# EAGLE design MITAvionicsRevA (EAGLE 7.2.0)
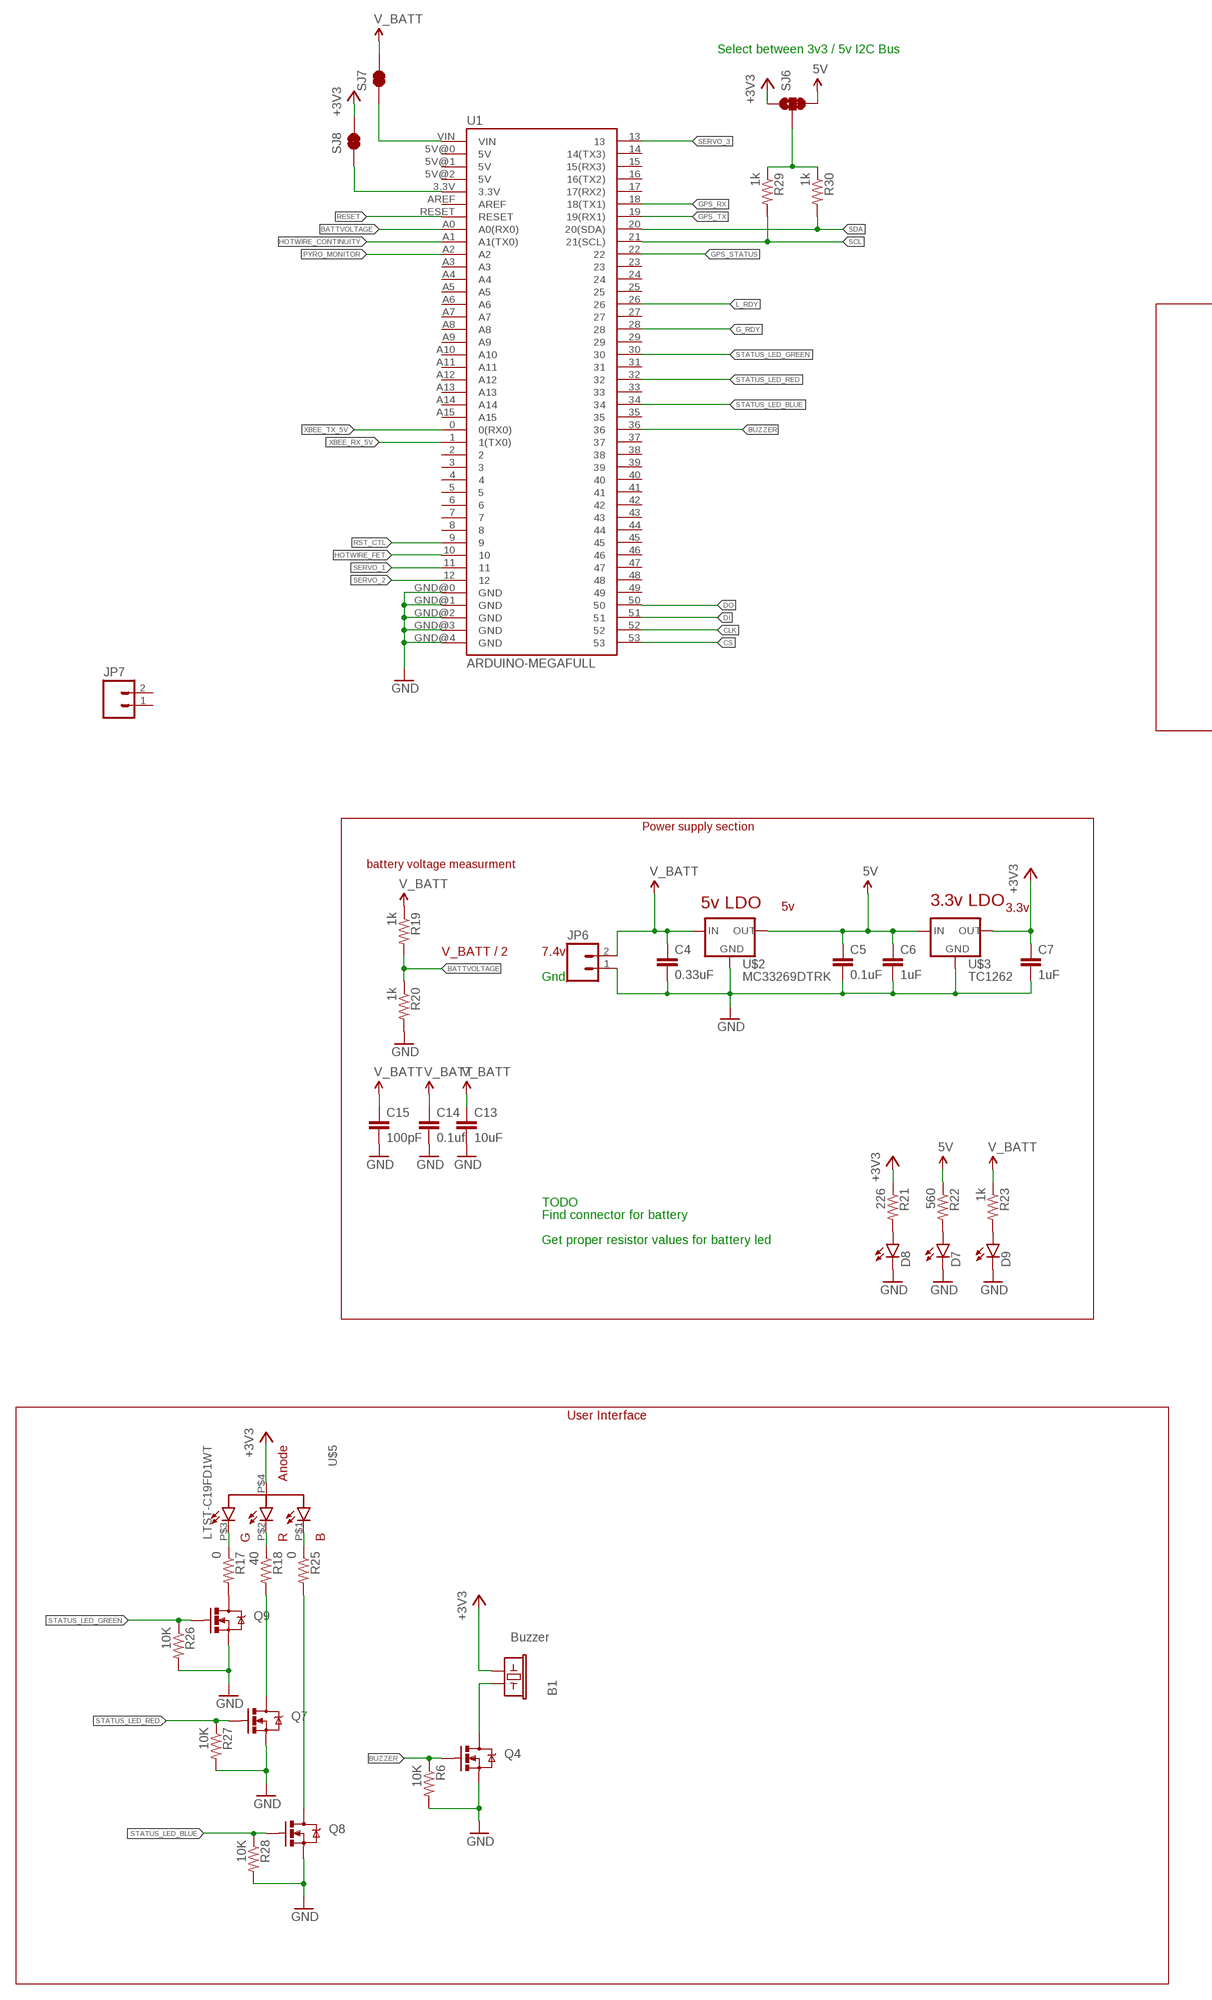
[diagram p0: schematic, sheet 1, part 1 of 2]
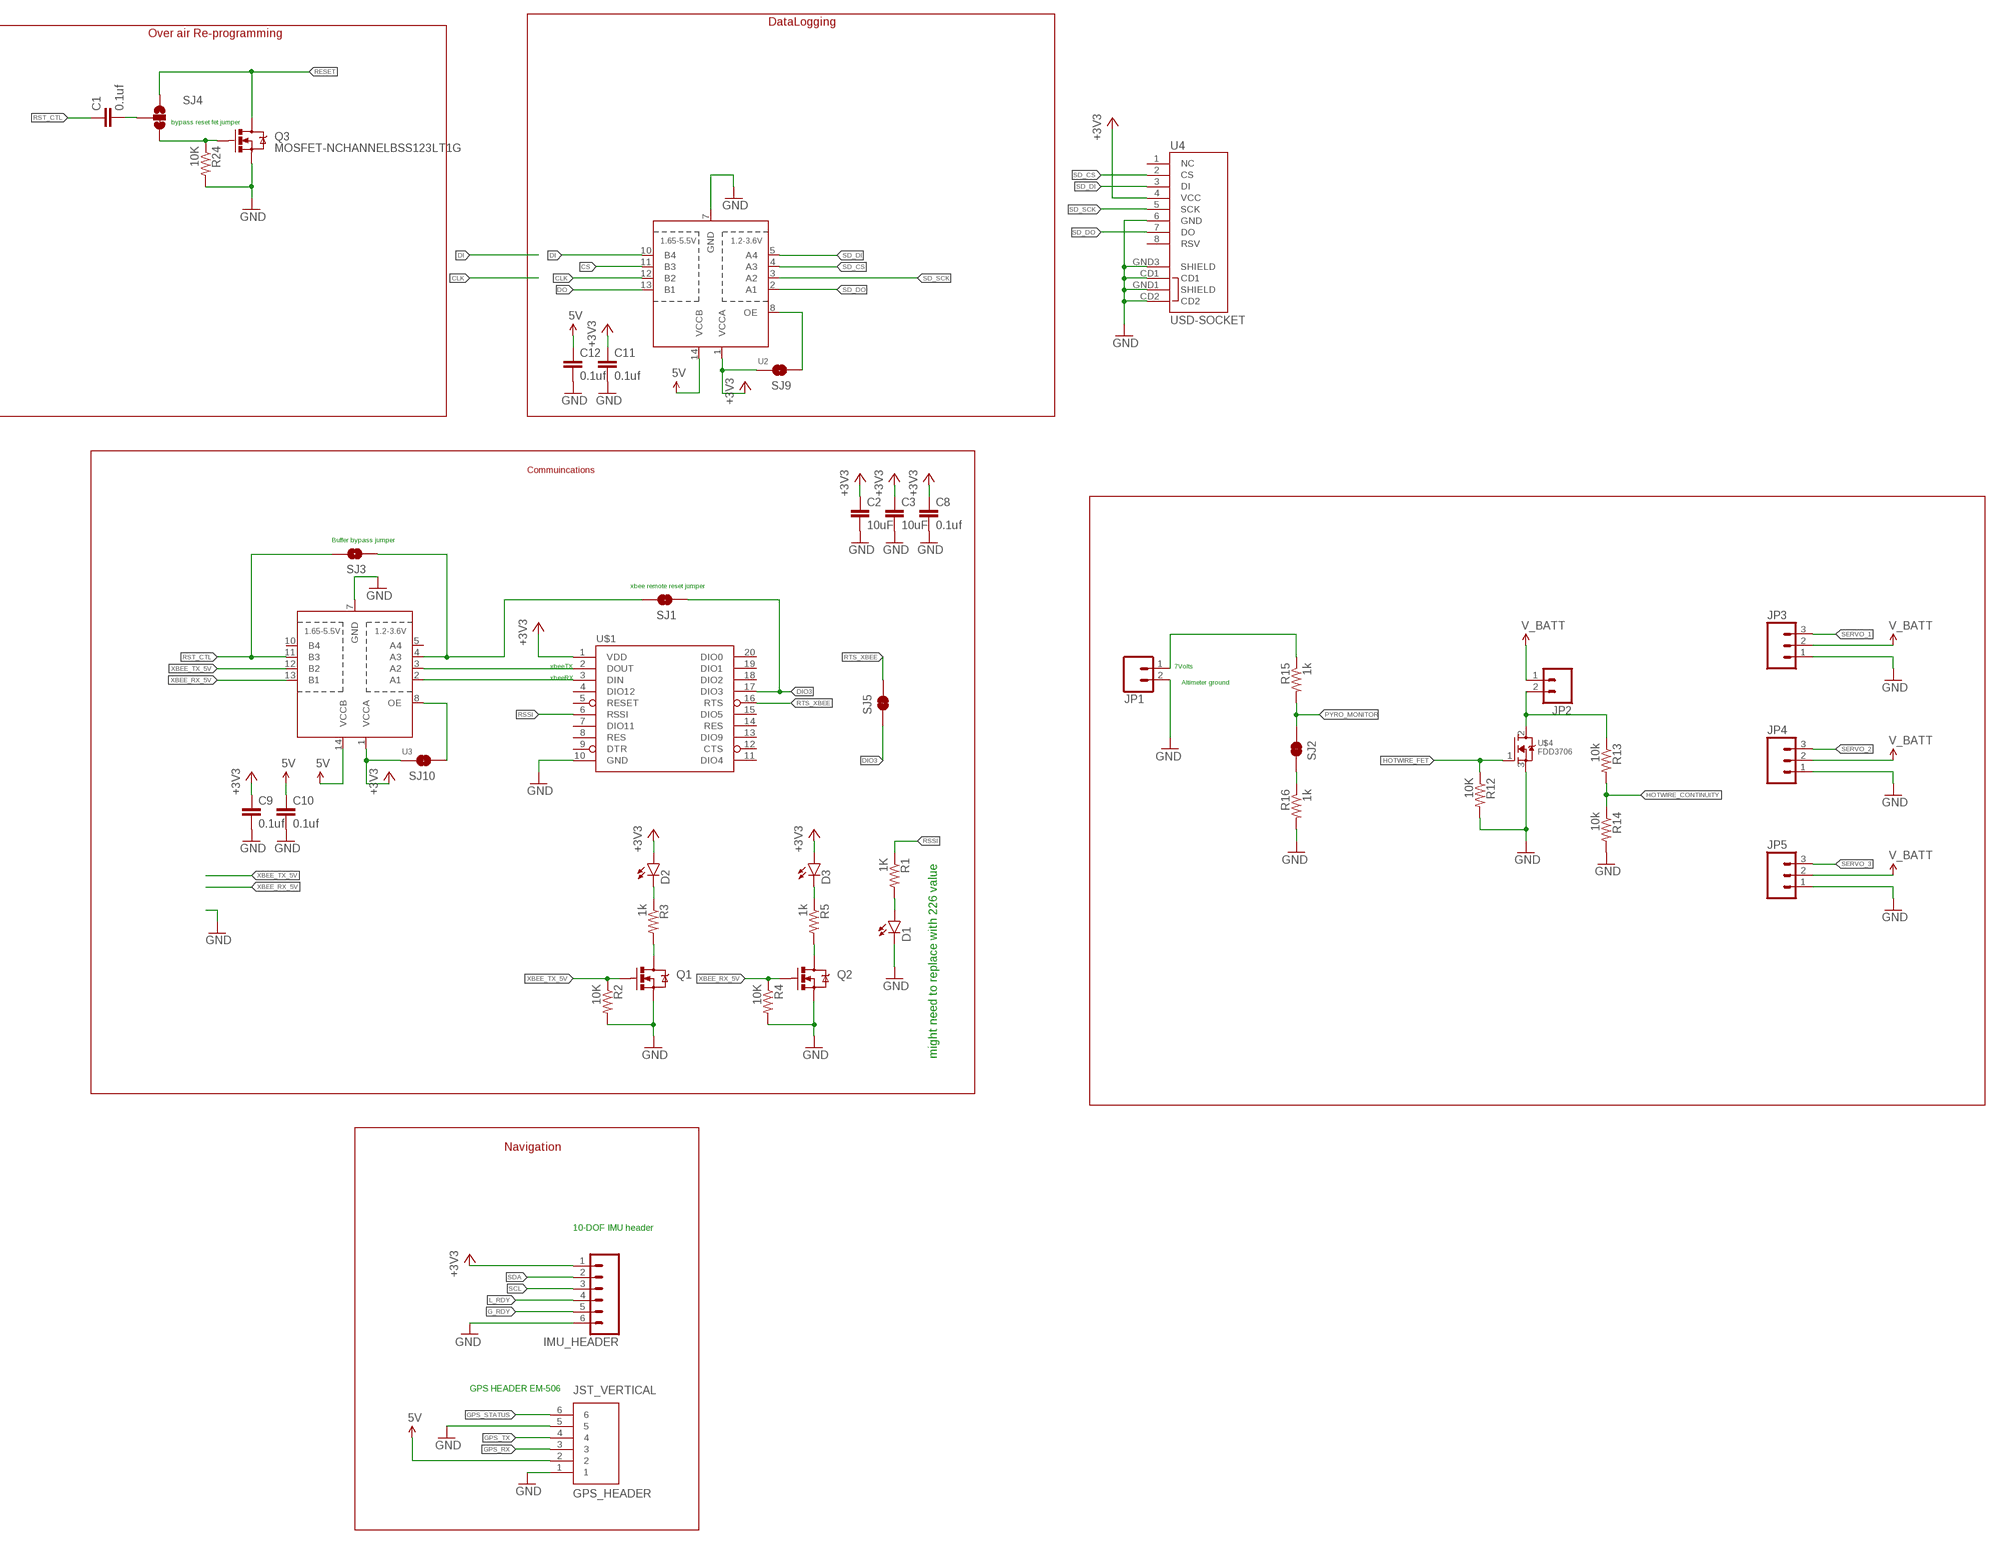
[diagram p1: schematic, sheet 1, part 2 of 2]

## Parts
B1  Buzzer  BUZZERSMD2  [BUZZER-CCV]
C1  0.1uf  CAP0805  [0805]
C2  10uF  CAP0805  [0805]
C3  10uF  CAP0805  [0805]
C4  0.33uF  CAP0805  [0805]
C5  0.1uF  CAP0805  [0805]
C6  1uF  CAP0805  [0805]
C7  1uF  CAP0805  [0805]
C8  0.1uf  CAP0805  [0805]
C9  0.1uf  CAP0805  [0805]
C10  0.1uf  CAP0805  [0805]
C11  0.1uf  CAP0805  [0805]
C12  0.1uf  CAP0805  [0805]
C13  10uF  CAP0805  [0805]
C14  0.1uf  CAP0805  [0805]
C15  100pF  CAP0805  [0805]
D1  LED1206  [LED-1206]
D2  LED1206  [LED-1206]
D3  LED1206  [LED-1206]
D7  LED1206  [LED-1206]
D8  LED1206  [LED-1206]
D9  LED1206  [LED-1206]
GPS_HEADER  JST_VERTICAL  [JST-6-SMD-VERT-1.0MM]
IMU_HEADER  M06SMD-1MM  [1X06-1MM]
JP1  M023.5MM  [SCREWTERMINAL-3.5MM-2]
JP2  M023.5MM  [SCREWTERMINAL-3.5MM-2]
JP3  M03PTH  [1X03]
JP4  M03PTH  [1X03]
JP5  M03PTH  [1X03]
JP6  M023.5MM  [SCREWTERMINAL-3.5MM-2]
JP7  M02PTH  [1X02]
Q1  MOSFET-NCHANNELBSS123LT1G  [SOT23-3]
Q2  MOSFET-NCHANNELBSS123LT1G  [SOT23-3]
Q3  MOSFET-NCHANNELBSS123LT1G  [SOT23-3]
Q4  MOSFET-NCHANNELBSS123LT1G  [SOT23-3]
Q7  MOSFET-NCHANNELBSS123LT1G  [SOT23-3]
Q8  MOSFET-NCHANNELBSS123LT1G  [SOT23-3]
Q9  MOSFET-NCHANNELBSS123LT1G  [SOT23-3]
R1  1K  RESISTOR0805-RES  [0805]
R2  10K  RESISTOR0805-RES  [0805]
R3  1k  RESISTOR0805-RES  [0805]
R4  10K  RESISTOR0805-RES  [0805]
R5  1k  RESISTOR0805-RES  [0805]
R6  10K  RESISTOR0805-RES  [0805]
R12  10K  RESISTOR0805-RES  [0805]
R13  10k  RESISTOR0805-RES  [0805]
R14  10k  RESISTOR0805-RES  [0805]
R15  1k  RESISTOR0805-RES  [0805]
R16  1k  RESISTOR0805-RES  [0805]
R17  0  RESISTOR0805-RES  [0805]
R18  40  RESISTOR0805-RES  [0805]
R19  1k  RESISTOR0805-RES  [0805]
R20  1k  RESISTOR0805-RES  [0805]
R21  226  RESISTOR0805-RES  [0805]
R22  560  RESISTOR0805-RES  [0805]
R23  1k  RESISTOR0805-RES  [0805]
R24  10K  RESISTOR0805-RES  [0805]
R25  0  RESISTOR0805-RES  [0805]
R26  10K  RESISTOR0805-RES  [0805]
R27  10K  RESISTOR0805-RES  [0805]
R28  10K  RESISTOR0805-RES  [0805]
R29  1k  RESISTOR0805-RES  [0805]
R30  1k  RESISTOR0805-RES  [0805]
SJ1  JUMPER-PAD-2-NC_BY_TRACE  [PAD-JUMPER-2-NC_BY_TRACE_YES_SILK]
SJ2  JUMPER-PAD-2-NC_BY_TRACE  [PAD-JUMPER-2-NC_BY_TRACE_YES_SILK]
SJ3  JUMPER-PAD-2-NOYES_SILK  [PAD-JUMPER-2-NO_YES_SILK]
SJ4  JUMPER-PAD-3-2OF3_NC_BY_TRACE_SMALL  [PAD-JUMPER-3-2OF3_NC_BY_TRACE_YES_SILK_FULL_BOX]
SJ5  JUMPER-PAD-2-NC_BY_TRACE  [PAD-JUMPER-2-NC_BY_TRACE_YES_SILK]
SJ6  JUMPER-PAD-3-2OF3_NC_BY_TRACE_SMALL  [PAD-JUMPER-3-2OF3_NC_BY_TRACE_YES_SILK_FULL_BOX]
SJ7  JUMPER-PAD-2-NC_BY_TRACE  [PAD-JUMPER-2-NC_BY_TRACE_YES_SILK]
SJ8  JUMPER-PAD-2-NC_BY_TRACE  [PAD-JUMPER-2-NC_BY_TRACE_YES_SILK]
SJ9  JUMPER-PAD-2-NC_BY_TRACE  [PAD-JUMPER-2-NC_BY_TRACE_YES_SILK]
SJ10  JUMPER-PAD-2-NC_BY_TRACE  [PAD-JUMPER-2-NC_BY_TRACE_YES_SILK]
U1  ARDUINO-MEGAFULL  [ARDUINO_MEGA]
U2  TXB0104PWRSOIC14  [SO14]
U3  TXB0104PWRSOIC14  [SO14]
U4  USD-SOCKET  [MICROSD_1:1]
U$1  XBEE-1B3  [XBEE-SMD]
U$2  MC33269DTRK  [TO-252]
U$3  TC1262  [SOT223]
U$4  FDD3706  [TO-252]
U$5  LTST-C19FD1WT  [SMD-4]

## Nets
5V: C5.1 C6.1 C10.1 C12.1 GPS_HEADER.2 R22.1 SJ6.3 U2.14(VCCB) U3.14(VCCB) U$2.2(OUT) U$3.1(IN)
+3V3: B1.- C2.1 C3.1 C7.1 C8.1 C9.1 C11.1 D2.A D3.A IMU_HEADER.1 R21.1 SJ6.1 SJ8.2 SJ9.2 SJ10.2 U2.1(VCCA) U3.1(VCCA) U4.4(VCC) U$1.1(VDD) U$3.3(OUT) U$5.P$4(VCC)
BATTVOLTAGE: R19.2 R20.1 U1.A0(A0(RX0))
BUZZER: Q4.1(G) R6.1 U1.36
CLK: U1.52 U2.12(B2)
CS: U1.53 U2.11(B3)
DI: U1.51 U2.10(B4)
DIO3: SJ1.1 SJ5.1 U$1.17(DIO3)
DO: U1.50 U2.13(B1)
G_RDY: IMU_HEADER.5 U1.28
GND: C2.2 C3.2 C4.2 C5.2 C6.2 C7.2 C8.2 C9.2 C10.2 C11.2 C12.2 C13.2 C14.2 C15.2 D1.C D7.C D8.C D9.C GPS_HEADER.1 GPS_HEADER.5 IMU_HEADER.6 JP1.2 JP3.1 JP4.1 JP5.1 JP6.1 Q1.2(S) Q2.2(S) Q3.2(S) Q4.2(S) Q7.2(S) Q8.2(S) Q9.2(S) R2.2 R4.2 R6.2 R12.2 R14.2 R16.2 R20.2 R24.2 R26.2 R27.2 R28.2 U1.GND@0(GND) U1.GND@1(GND) U1.GND@2(GND) U1.GND@3(GND) U1.GND@4(GND) U2.7(GND) U3.7(GND) U4.6(GND) U4.CD1 U4.CD2 U4.GND1(SHIELD) U4.GND3(SHIELD) U$1.10(GND) U$2.1(GND) U$3.2(GND) U$4.3(S)
GPS_RX: GPS_HEADER.3 U1.18(18(TX1))
GPS_STATUS: GPS_HEADER.6 U1.22
GPS_TX: GPS_HEADER.4 U1.19(19(RX1))
HOTWIRE_CONTINUITY: R13.2 R14.1 U1.A1(A1(TX0))
HOTWIRE_FET: R12.1 U1.10 U$4.1(G)
L_RDY: IMU_HEADER.4 U1.26
N$1: D1.A R1.2
N$2: SJ1.2 SJ3.1 U3.4(A3)
N$3: SJ8.1 U1.3.3V
N$4: D3.C R5.1
N$5: JP2.2 R13.1 U$4.2(D)
N$6: Q3.1(G) R24.1 SJ4.3
N$7: C1.2 SJ4.2
N$8: B1.+ Q4.3(D)
N$9: Q2.3(D) R5.2
N$10: D2.C R3.1
N$11: Q1.3(D) R3.2
N$15: SJ9.1 U2.8(OE)
N$17: SJ10.1 U3.8(OE)
N$21: Q9.3(D) R17.2
N$22: Q7.3(D) R18.2
N$23: D7.A R22.2
N$24: D8.A R21.2
N$25: D9.A R23.2
N$26: Q8.3(D) R25.2
N$27: JP1.1 R15.1
N$28: R29.1 R30.1 SJ6.2
N$29: SJ7.1 U1.VIN
N$30: R16.1 SJ2.1
N$36: R17.1 U$5.P$3(GREEN)
N$37: R18.1 U$5.P$2(RED)
N$38: R25.1 U$5.P$1(BLUE)
PYRO_MONITOR: R15.2 SJ2.2 U1.A2
RESET: Q3.3(D) SJ4.1 U1.RESET
RSSI: R1.1 U$1.6(RSSI)
RST_CTL: C1.1 SJ3.2 U1.9 U3.11(B3)
RTS_XBEE: SJ5.2 U$1.16(RTS)
SCL: IMU_HEADER.3 R29.2 U1.21(21(SCL))
SD_CS: U2.4(A3) U4.2(CS)
SD_DI: U2.5(A4) U4.3(DI)
SD_DO: U2.2(A1) U4.7(DO)
SD_SCK: U2.3(A2) U4.5(SCK)
SDA: IMU_HEADER.2 R30.2 U1.20(20(SDA))
SERVO_1: JP3.3 U1.11
SERVO_2: JP4.3 U1.12
SERVO_3: JP5.3 U1.13
STATUS_LED_BLUE: Q8.1(G) R28.1 U1.34
STATUS_LED_GREEN: Q9.1(G) R26.1 U1.30
STATUS_LED_RED: Q7.1(G) R27.1 U1.32
V_BATT: C4.1 C13.1 C14.1 C15.1 JP2.1 JP3.2 JP4.2 JP5.2 JP6.2 R19.1 R23.1 SJ7.2 U$2.3(IN)
XBEE_RX_3V3: U3.2(A1) U$1.3(DIN)
XBEE_RX_5V: Q2.1(G) R4.1 U1.1(1(TX0)) U3.13(B1)
XBEE_TX_3V3: U3.3(A2) U$1.2(DOUT)
XBEE_TX_5V: Q1.1(G) R2.1 U1.0(0(RX0)) U3.12(B2)
Unconnected: JP7.1 JP7.2 U1.2 U1.3 U1.4 U1.5 U1.5V@0(5V) U1.5V@1(5V) U1.5V@2(5V) U1.6 U1.7 U1.8 U1.14(14(TX3)) U1.15(15(RX3)) U1.16(16(TX2)) U1.17(17(RX2)) U1.23 U1.24 U1.25 U1.27 U1.29 U1.31 U1.33 U1.35 U1.37 U1.38 U1.39 U1.40 U1.41 U1.42 U1.43 U1.44 U1.45 U1.46 U1.47 U1.48 U1.49 U1.A3 U1.A4 U1.A5 U1.A6 U1.A7 U1.A8 U1.A9 U1.A10 U1.A11 U1.A12 U1.A13 U1.A14 U1.A15 U1.AREF U3.5(A4) U3.10(B4) U4.1(NC) U4.8(RSV) U$1.4(DIO12) U$1.5(RESET) U$1.7(DIO11) U$1.8(RES) U$1.9(DTR) U$1.11(DIO4) U$1.12(CTS) U$1.13(DIO9) U$1.14(RES) U$1.15(DIO5) U$1.18(DIO2) U$1.19(DIO1) U$1.20(DIO0)

## Notes on the sheet
- Select between 3v3 / 5v I2C Bus
- DataLogging
- Over air Re-programming
- bypass reset fet jumper
- Commuincations
- Power supply section
- battery voltage measurment | Buffer bypass jumper
- 5v LDO | 3.3v LDO
- xbee remote reset jumper
- V_BATT / 2 | 7.4v
- Gnd
- xbeeTX | 7Volts
- xbeeRX | Altimeter ground
- TODO
- Find connector for battery | might need to replace with 226 value
- Get proper resistor values for battery led
- User Interface
- Navigation
- 10-DOF IMU header
- GPS HEADER EM-506

## Library data of the parts
B1 = SparkFun:BUZZER: Buzzer 12mm Spark Fun Electronics SKU : Comp-Buzzer; DIGIKEY: 102-1265-1-ND
C1 C4-C12 C14 C15 = SparkFun-Capacitors:CAP: Capacitor Standard 0603 ceramic capacitor, and 0.1" leaded capacitor.
C2 C3 C13 = SparkFun-Capacitors:CAP: Capacitor Standard 0603 ceramic capacitor, and 0.1" leaded capacitor.; DIGIKEY: 490-3886-1-ND
D1-D3 D7-D9 = SparkFun-LED:LED: LEDs Standard schematic elements and footprints for 5mm, 3mm, 1206, and 0603 sized LEDs. 5mm - Spark Fun Electronics SKU : COM-00529 (and others); DIGIKEY: 160-1405-1-ND
GPS_HEADER = SparkFun-Connectors:JST_VERTICAL; DIGIKEY: 455-1792-1-ND; PROD_ID: CONN-08249
IMU_HEADER = SparkFun-Connectors:M06: Header 6 Standard 6-pin 0.1" header. Use with straight break away headers (SKU : PRT-00116), right angle break away headers (PRT-00553), swiss pins (PRT-00743), machine pins (PRT-00117), and female headers (PRT-00115). Molex polarized connector foot print use with SKU : PRT-08094 with associated crimp pins and housings. NOTES ON THE VARIANTS LOCK and LOCK_LONGPADS... This footprint was designed to help hold the alignment of a through-hole component (i.e. 6-pin header) while soldering it into place. You may notice that each hole has been shifted either up or down by 0.005 of an inch from it's more standard position (which is a perfectly straight line). This slight alteration caused the pins (the squares in the middle) to touch the edges of the holes. Because they are alternating, it causes a "brace" to hold the component in place. 0.005 has proven to be the perfect amount of "off-center" position when using our standard breakaway headers. Although looks a little odd when you look at the bare footprint, once you have a header in there, the alteration is very hard to notice. Also,if you push a header all the way into place, it is covered up entirely on the bottom side. This idea of altering the position of holes to aid alignment will be further integrated into the Sparkfun Library for other footprints. It can help hold any component with 3 or more connection pins.; DIGIKEY: 455-1806-2-ND
JP1 JP2 JP6 = SparkFun-Connectors:M02: Standard 2-pin 0.1" header. Use with - straight break away headers ( PRT-00116) - right angle break away headers (PRT-00553) - swiss pins (PRT-00743) - machine pins (PRT-00117) - female headers (PRT-00115) Molex polarized connector foot print use with: PRT-08233 with associated crimp pins and housings. 2.54_SCREWTERM for use with PRT-10571. 3.5mm Screw Terminal footprints for PRT-08084 5mm Screw Terminal footprints for use with PRT-08432; PROD_ID: CONN-08399
JP3-JP5 = SparkFun-Connectors:M03: Header 3 Standard 3-pin 0.1" header. Use with straight break away headers (SKU : PRT-00116), right angle break away headers (PRT-00553), swiss pins (PRT-00743), machine pins (PRT-00117), and female headers (PRT-00115). Molex polarized connector foot print use with SKU : PRT-08232 with associated crimp pins and housings.
JP7 = SparkFun-Connectors:M02: Standard 2-pin 0.1" header. Use with - straight break away headers ( PRT-00116) - right angle break away headers (PRT-00553) - swiss pins (PRT-00743) - machine pins (PRT-00117) - female headers (PRT-00115) Molex polarized connector foot print use with: PRT-08233 with associated crimp pins and housings. 2.54_SCREWTERM for use with PRT-10571. 3.5mm Screw Terminal footprints for PRT-08084 5mm Screw Terminal footprints for use with PRT-08432
Q1-Q4 Q7-Q9 = SparkFun-DiscreteSemi:MOSFET-NCHANNEL: Common NMOSFET Parts MFG P/N Store ID Prod ID FDD8780 TRANS-09984 SI7820DN TRANS-11055 FDS6630A IC-08089 2N7002PW TRANS-11151 FQP30N06L COM-10213 TRANS-10060 BSS123LT1G TRANS-08345 BSS138 TRANS-00830 BS170 2N7000; PROD_ID: TRANS-08345
R1-R6 R12-R20 R24-R30 = SparkFun-Resistors:RESISTOR: Resistor Basic schematic elements and footprints for 0603, 1206, and PTH resistors.
R21 = SparkFun-Resistors:RESISTOR: Resistor Basic schematic elements and footprints for 0603, 1206, and PTH resistors.; DIGIKEY: P226CCT-ND
R22 = SparkFun-Resistors:RESISTOR: Resistor Basic schematic elements and footprints for 0603, 1206, and PTH resistors.; DIGIKEY: P560CCT-ND
R23 = SparkFun-Resistors:RESISTOR: Resistor Basic schematic elements and footprints for 0603, 1206, and PTH resistors.; DIGIKEY: P2.00KCCT-ND
SJ1 SJ2 SJ5 SJ7-SJ10 = SparkFun-Passives:JUMPER-PAD-2-NC_BY_TRACE
SJ3 = SparkFun-Passives:JUMPER-PAD-2-NO
SJ4 SJ6 = SparkFun-Passives:JUMPER-PAD-3-2OF3_NC_BY_TRACE
U1 = SparkFun-Boards:ARDUINO-MEGA: Arduino Mega board footprint
U2 U3 = SparkFun-DigitalIC:TXB0104PWR: 4-Bit Bi-Directional Level Shifter 1.2V-3.6V (VCCA) to 1.65V-5.5V (VCCB) bi-directional level shifter with auto direction sensing. Max data rate - VCCA 1.8V: 20Mbps (50ns), VCCA 3.3V: 100Mbps (10ns) Digikey: 296-21929-1-ND (TSSOP) IC-11329; PROD_ID: IC-11329
U4 = SparkFun-Connectors:USD-SOCKET: microSD Socket Push-push type uSD socket. Schematic element and footprint production proven. Spark Fun Electronics SKU : PRT-00127. tDoc lines correctly indicate media card edge positions when inserting (unlocked, locked, depressed). NOTE: CD1 and CD2 are connected internally; PROD_ID: CONN-07820
U$1 = SparkFun-RF:XBEE-1: Xbee module footprints; PROD_ID: CONN-09042
U$2 = RitLaunchInitiative:MC33269DTRK: 5v Reg; DIGIKEY: MC33269DTRK-5.0GOSCT-ND
U$3 = RitLaunchInitiative:TC1262: 3.3v Reg; DIGIKEY: TC1262-3.3VDBCT-ND
U$4 = RitLaunchInitiative:FDD3706; DATASHEET_LINK: https://www.fairchildsemi.com/datasheets/FD/FDD3706.pdf; DIGIKEY_PART_NUMBER: FDD3706FSCT-ND
U$5 = RitLaunchInitiative:LTST-C19FD1WT: |SMD RGB LED| |LTST-C19FD1WT| --------------------------------------------------------------------------------------------------------------------------------- |Common Anode| --------------------------------------------------------------------------------------------------------------------------------- |Blue Forward Current: 20ma| |Green Forward Current: 20ma| |Red Forward Current: 30ma| --------------------------------------------------------------------------------------------------------------------------------- |Blue Forward Voltage: 3.5V| |Green Forward Voltage: 3.5V| |Red Forward Voltage: 2V| --------------------------------------------------------------------------------------------------------------------------------- |Reverse voltage 5v| --------------------------------------------------------------------------------------------------------------------------------- Datasheet: http://optoelectronics.liteon.com/upload/download/DS22-2001-076/S_110_LTST-C19FD1WT.pdf; DIGIKEY: 160-2022-1-ND; MPN: LTST-C19FD1WT

## Board
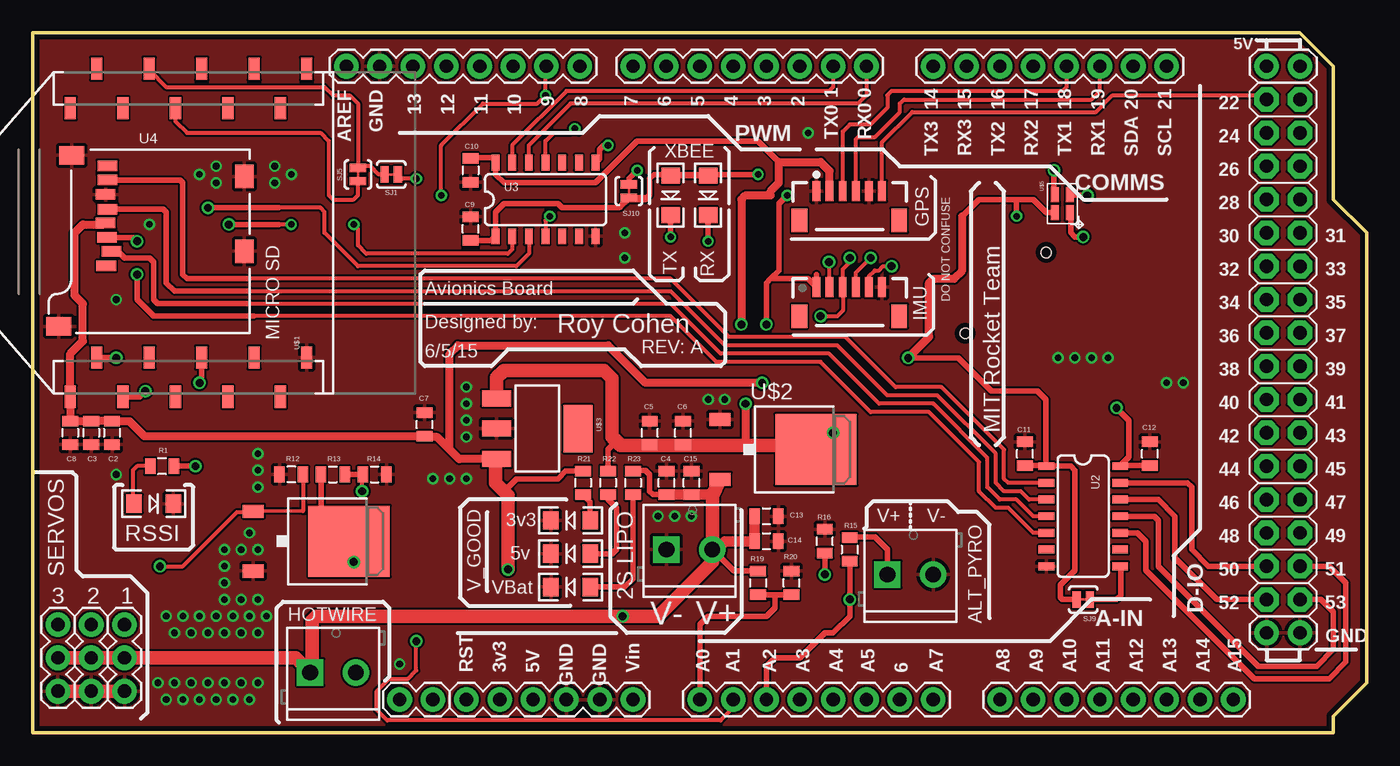
[diagram p2: board, top side]
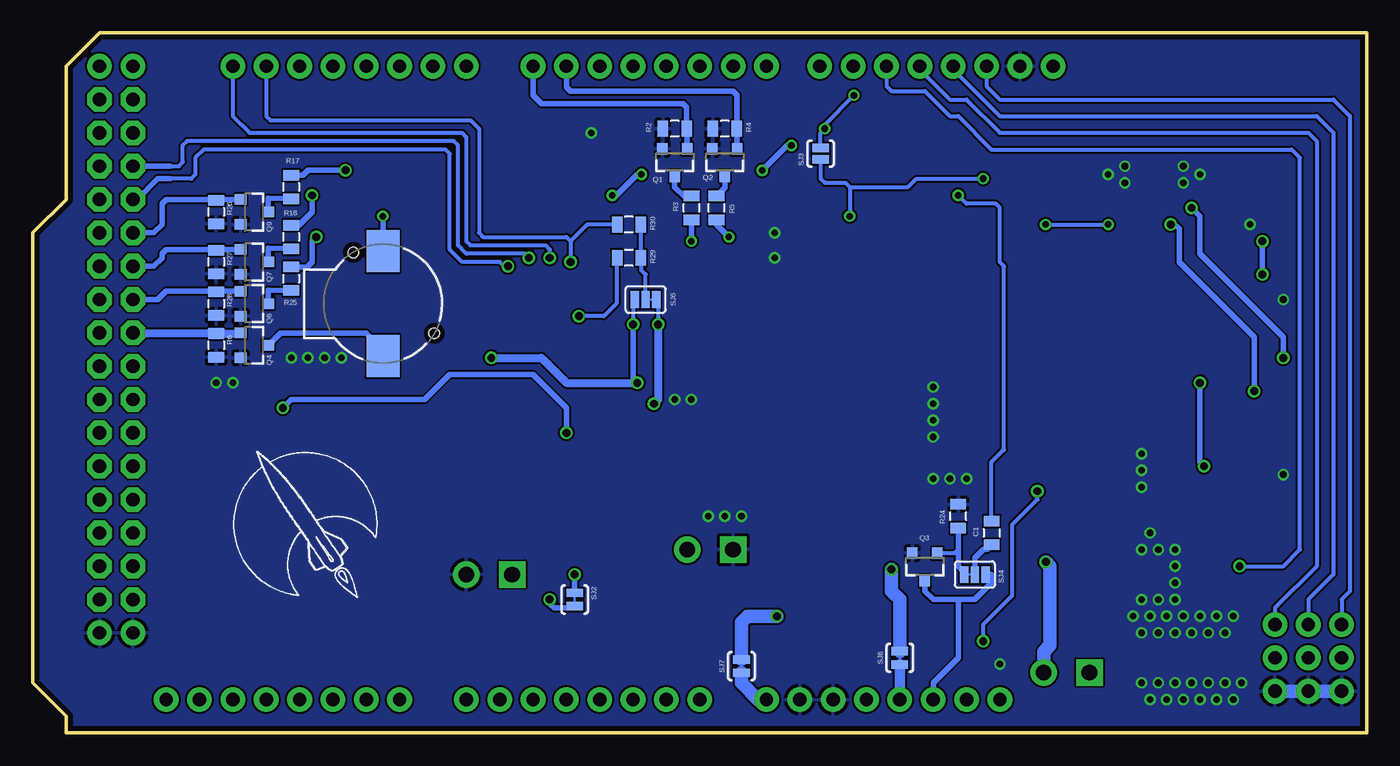
[diagram p3: board, bottom side, seen from below]

Size 101.6 x 53.34 mm. Coordinates in mm from the lower left corner, seen from the top.
Outline: 0,53.34 0,0 99.06,0 99.06,1.27 101.6,3.81 101.6,38.1 99.06,40.64 99.06,50.8 96.52,53.34 0,53.34
Copper layers (1*16): Top 0.0356mm / dielectric 1.5011mm / Bottom 0.0356mm
Design rules "LaenPCBOrder *": minimum track width 6mil, minimum drill 13mil, track to track 6mil, track to pad 6mil, pad to pad 6mil, via to via 6mil, smd to smd 6mil, copper to edge 15mil, drill to drill 6mil, minimum pad ring 7mil, minimum via ring 7mil, stop-mask expansion 3mil, vias tented up to drill 25mil, thermal gap 10mil

### Footprints (pad centres in the part's own frame; a part is rotated, then mirrored left to right if it is on the bottom)
BUZZER-CCV = smd 3.2 x 2.5: + 4,0; - -4,0 | hole 0.8: -3.9,-2.25; 2.25,3.9
0805 = smd 0.8 x 1.2: 1 -0.9,0; 2 0.9,0
LED-1206 = smd 1.2 x 1.4: A -1.5,0; C 1.5,0
JST-6-SMD-VERT-1.0MM = smd 0.6 x 1.55: 1 -2.54,1.27; 2 -1.54,1.27; 3 -0.54,1.27; 4 0.46,1.27; 5 1.46,1.27; 6 2.46,1.27 | smd 1.2 x 1.8: P$1 -3.84,-0.955; P$2 3.76,-0.955
1X06-1MM = smd 0.6 x 1.55: 1 -2.54,1.27; 2 -1.54,1.27; 3 -0.54,1.27; 4 0.46,1.27; 5 1.46,1.27; 6 2.46,1.27 | smd 1.2 x 1.8: P$1 -3.84,-0.955; P$2 3.76,-0.955
SCREWTERMINAL-3.5MM-2 = drill 1.2 pad 2.032 square: 1 0,0 | drill 1.2 pad 2.032: 2 3.5,0
1X03 = drill 1.016 pad 1.88: 1 0,0; 2 2.54,0; 3 5.08,0
1X02 = drill 1.016 pad 1.88: 1 0,0; 2 2.54,0
SOT23-3 = smd 0.8 x 0.9: 1 -0.95,-1; 2 0.95,-1; 3 0,1.1
PAD-JUMPER-2-NC_BY_TRACE_YES_SILK = smd 0.635 x 1.27: 1 -0.508,0; 2 0.508,0
PAD-JUMPER-2-NO_YES_SILK = smd 0.635 x 1.27: 1 -0.45,0; 2 0.45,0
PAD-JUMPER-3-2OF3_NC_BY_TRACE_YES_SILK_FULL_BOX = smd 0.635 x 1.27: 1 -0.813,0; 2 0,0; 3 0.813,0
ARDUINO_MEGA = drill 1.016 pad 1.88: 0 63.5,50.8; 1 60.96,50.8; 2 58.42,50.8; 3 55.88,50.8; 3.3V 35.56,2.54; 4 53.34,50.8; 5 50.8,50.8; 5V@0 38.1,2.54; 5V@1 93.98,50.8; 5V@2 96.52,50.8; 6 48.26,50.8; 7 45.72,50.8; 8 41.656,50.8; 9 39.116,50.8; 10 36.576,50.8; 11 34.036,50.8; 12 31.496,50.8; 13 28.956,50.8; 14 68.58,50.8; 15 71.12,50.8; 16 73.66,50.8; 17 76.2,50.8; 18 78.74,50.8; 19 81.28,50.8; 20 83.82,50.8; 21 86.36,50.8; A0 50.8,2.54; A1 53.34,2.54; A2 55.88,2.54; A3 58.42,2.54; A4 60.96,2.54; A5 63.5,2.54; A6 66.04,2.54; A7 68.58,2.54; A8 73.66,2.54; A9 76.2,2.54; A10 78.74,2.54; A11 81.28,2.54; A12 83.82,2.54; A13 86.36,2.54; A14 88.9,2.54; A15 91.44,2.54; AREF 23.876,50.8; GND@0 40.64,2.54; GND@1 43.18,2.54; GND@2 93.98,7.62; GND@3 96.52,7.62; GND@4 26.416,50.8; RESET 33.02,2.54; VIN 45.72,2.54 | drill 1.016 pad 1.88 octagon: 22 93.98,48.26; 23 96.52,48.26; 24 93.98,45.72; 25 96.52,45.72; 26 93.98,43.18; 27 96.52,43.18; 28 93.98,40.64; 29 96.52,40.64; 30 93.98,38.1; 31 96.52,38.1; 32 93.98,35.56; 33 96.52,35.56; 34 93.98,33.02; 35 96.52,33.02; 36 93.98,30.48; 37 96.52,30.48; 38 93.98,27.94; 39 96.52,27.94; 40 93.98,25.4; 41 96.52,25.4; 42 93.98,22.86; 43 96.52,22.86; 44 93.98,20.32; 45 96.52,20.32; 46 93.98,17.78; 47 96.52,17.78; 48 93.98,15.24; 49 96.52,15.24; 50 93.98,12.7; 51 96.52,12.7; 52 93.98,10.16; 53 96.52,10.16
SO14 = smd 0.6 x 1.2: 1 -3.81,-2.8; 2 -2.54,-2.8; 3 -1.27,-2.8; 4 0,-2.8; 5 1.27,-2.8; 6 2.54,-2.8; 7 3.81,-2.8; 8 3.81,2.8; 9 2.54,2.8; 10 1.27,2.8; 11 0,2.8; 12 -1.27,2.8; 13 -2.54,2.8; 14 -3.81,2.8
MICROSD_1:1 = smd 0.8 x 1.5: 1 5.096,10.919; 2 6.218,10.519; 3 7.274,10.853; 4 8.367,10.982; 5 9.421,10.828; 6 10.539,10.973; 7 11.648,10.819; 8 12.721,10.819 | smd 1.8 x 1.4: CD1 11.92,0.4; CD2 6.22,0.4 | smd 1.4 x 1.9: GND1 0.497,14.55; GND3 13.52,13.55
XBEE-SMD = smd 1.7 x 0.85: 1 -12.5,20; 2 -9.5,18; 3 -12.5,16; 4 -9.5,14; 5 -12.5,12; 6 -9.5,10; 7 -12.5,8; 8 -9.5,6; 9 -12.5,4; 10 -9.5,2; 11 12.5,2; 12 9.5,4; 13 12.5,6; 14 9.5,8; 15 12.5,10; 16 9.5,12; 17 12.5,14; 18 9.5,16; 19 12.5,18; 20 9.5,20
TO-252 = smd 1 x 1.6: 1 -2.28,-4.8; 3 2.28,-4.8 | smd 5.4 x 6.2: 2 0,2.5
SOT223 = smd 1.219 x 2.235: 1 -2.311,-3.099; 2 0,-3.099; 3 2.311,-3.099 | smd 3.6 x 2.2: 4 0,3.099
SMD-4 = smd 1.143 x 0.635: P$1 0.699,0.572; P$2 -0.699,0.572; P$3 -0.699,-0.572; P$4 0.699,-0.572

### Placement (x,y rotation side)
B1  74.93,32.7 270 bottom
C1  28.57,15.24 270 bottom
C2  6.03,22.86 270 top
C3  4.45,22.86 270 top
C4  48.26,19.05 90 top
C5  46.99,22.86 90 top
C6  49.53,22.86 90 top
C7  29.84,23.5 90 top
C8  2.86,22.86 270 top
C9  33.34,38.42 90 top
C10  33.34,42.86 270 top
C11  75.56,21.27 90 top
C12  85.09,21.27 90 top
C13  55.88,16.51 0 top
C14  55.88,14.61 0 top
C15  50.16,19.05 90 top
D1  9.21,17.46 0 top
D2  51.44,40.96 270 top
D3  48.58,40.96 270 top
D7  40.96,13.65 180 top
D8  40.96,16.19 180 top
D9  40.96,11.11 180 top
GPS_HEADER  62.23,40.01 0 top
IMU_HEADER  62.23,32.7 0 top
JP1  65.09,12.06 0 top
JP2  21.11,4.6 0 top
JP3  6.99,3.17 90 top
JP4  4.45,3.17 90 top
JP5  1.91,3.17 90 top
JP6  48.26,13.97 0 top
JP7  30.48,2.54 180 top
Q1  52.7,43.5 180 bottom
Q2  48.9,43.5 180 bottom
Q3  33.66,12.7 180 bottom
Q4  84.77,29.53 270 bottom
Q7  84.77,35.88 270 bottom
Q8  84.77,32.7 270 bottom
Q9  84.77,39.69 270 bottom
R1  9.84,20.32 180 top
R2  52.7,46.04 180 bottom
R3  51.44,40.01 90 bottom
R4  48.9,46.04 180 bottom
R5  49.53,40.01 90 bottom
R6  87.63,29.53 270 bottom
R12  19.68,19.68 180 top
R13  22.86,19.68 0 top
R14  26.04,19.68 0 top
R15  62.23,13.97 270 top
R16  60.33,14.61 90 top
R17  81.92,41.59 270 bottom
R18  81.92,37.78 270 bottom
R19  55.24,11.43 270 top
R20  57.78,11.43 90 top
R21  41.91,19.05 270 top
R22  43.81,19.05 270 top
R23  45.72,19.05 270 top
R24  31.11,16.51 90 bottom
R25  81.92,34.61 270 bottom
R26  87.63,39.69 270 bottom
R27  87.63,35.88 270 bottom
R28  87.63,32.7 270 bottom
R29  56.2,36.2 180 bottom
R30  56.2,38.73 180 bottom
SJ1  27.3,42.55 0 top
SJ2  60.33,10.16 270 bottom
SJ3  41.59,44.13 90 bottom
SJ4  29.84,12.06 180 bottom
SJ5  24.77,42.55 270 top
SJ6  54.93,33.02 0 bottom
SJ7  47.62,5.08 90 bottom
SJ8  35.56,5.71 90 bottom
SJ9  80.01,10.16 180 top
SJ10  45.4,41.27 270 top
U1  0,0 0 top
U2  80.01,16.51 270 top
U3  39.05,40.64 0 top
U4  16.51,30.48 90 top
U$1  22.86,38.1 90 top
U$2  57.15,21.59 270 top
U$3  38.42,23.18 270 top
U$4  21.59,14.61 270 top
U$5  78.42,40.32 270 top
U$7  [RITLAUNCH_LOGO_SMALLB]  81.28,16.51 0 top

### Tracks (layer width: path | path; a pad name or v marks a point on that pad's centre or on a via)
5V  (via drill 0.6)
  Top 0.406: R22.1 43.81,21.59 44.45,22.23 | C6.1 48.95,21.96 48.9,21.91 | C5.1 47.89,21.96 47.94,21.91 | 54.29,22.23 53.98,21.91 | U$2.2 59.69,21.59 v60.96,22.86 | v82.55,24.77 83.5,23.81 83.5,21.01 U2.14 82.86,20.37 C12.1 | 56.83,43.5 55.24,45.09 46.04,45.09 42.86,41.91 35.88,41.91 35.24,42.55 U3.14 35.24,43.5 34.92,43.81 33.39,43.81 C10.1
  Top 0.61: v53.98,31.11 53.98,40.64 54.29,40.96 56.2,40.96 56.2,41.27 56.83,41.91 56.83,43.5 60.01,43.5 60.69,42.81 GPS_HEADER.2 | v54.29,25.08 54.29,22.23
  Top 1.016: U$2.2 59.33,21.91 53.98,21.91 48.9,21.91 47.94,21.91 44.77,21.91 44.45,22.23 44.13,22.54 44.13,26.99 43.5,27.62 35.88,27.62 35.32,27.06 U$3.1
  Bottom 0.305: SJ6.3 53.98,32.88 v53.98,31.11
  Bottom 0.406: v60.96,22.86 60.96,24.77 63.5,27.3 69.85,27.3 71.75,25.4 81.92,25.4 v82.55,24.77
  Bottom 0.61: v53.98,31.11 53.98,25.4 v54.29,25.08
+3V3  (via drill 0.5, 0.6)
  Top 0.305: 44.45,40.01 44.77,40.01 45.4,40.64
  Top 0.406: R21.1 40.59,19.95 40.01,19.37 36.83,19.37 35.88,18.41 | U$5.P$4 77.22,39.62 76.2,40.64 74.93,40.64 | 59.69,34.92 IMU_HEADER.1 59.05,34.61 56.2,34.61 | v55.88,31.11 55.88,34.29 56.2,34.61 | 74.93,40.64 72.07,40.64 70.8,39.37 | v74.93,39.37 74.93,40.64 | v66.67,28.57 70.48,28.57 73.03,26.04 76.52,26.04 77.15,25.4 77.15,20.38 U2.1 | U2.1 79.06,20.32 79.38,20 79.38,12.38 78.26,11.27 78.26,10.32 78.42,10.16 SJ9.2 79.38,10.29 | C11.1 77.16,20.37 U2.1 | 46.8,40.77 SJ10.2 44.64,40.01 44.45,40.01 40.32,40.01 40.01,40.32 35.88,40.32 35.24,39.69 U3.1 34.92,37.52 C9.1 | 46.8,40.77 46.99,40.96 46.99,42.23 47.31,42.55 48.26,42.55 | 48.26,42.55 48.49,42.55 D3.A D2.A | 45.4,40.64 46.67,40.64 46.8,40.77 | 48.26,42.55 48.58,42.23 48.9,42.55 v55.24,42.55 | v57.47,40.96 56.83,40.32 56.83,35.24 56.2,34.61
  Top 0.61: 70.8,39.37 70.8,35.24 70.17,34.61 68.58,34.61 68.26,34.29 68.26,30.16 v66.67,28.57 | U$3.3 32.47,20.87 31.75,21.59 | 31.75,21.59 31.75,28.89 32.38,29.53 43.81,29.53 46.67,26.67 v55.56,26.67 | 31.75,21.59 30.8,22.54 29.9,22.54 C7.1 8.52,22.59 7.36,23.76 C2.1 C3.1 C8.1 U$1.1 2.86,28.89 3.81,29.84 3.81,32.7 3.17,33.34 3.17,38.1 3.81,38.73 5.42,38.73 U4.4
  Top 1.016: U$3.3 35.24,20.79 35.24,19.05 35.88,18.41 36.2,18.1 v36.2,12.45
  Bottom 0.305: SJ6.1 55.88,32.88 v55.88,31.11
  Bottom 0.406: v55.88,31.11 55.88,26.99 v55.56,26.67 | B1.- v74.93,39.37 | v55.24,42.55 55.56,42.55 57.15,40.96 v57.47,40.96
  Bottom 0.61: v66.67,28.57 62.87,28.57 60.96,26.67 v55.56,26.67
  Bottom 1.016: SJ8.2 35.56,10.16 36.2,10.79 v36.2,12.45
BATTVOLTAGE
  Top 0.406: U1.A0 50.8,8.26 51.44,8.89 55.88,8.89 56.52,9.53 56.52,10.53 | R19.2 56.52,10.53 | 56.52,10.53 R20.1
BUZZER
  Bottom 0.61: U1.36 87.68,30.48 R6.1 85.82,30.43 Q4.1
CLK
  Top 0.406: U2.12 85.72,17.78 87,16.51 87,13.34 90.17,10.16 U1.52
CS
  Top 0.406: U1.53 98.11,10.16 99.06,9.21 99.06,6.35 97.79,5.08 93.34,5.08 85.72,12.7 85.72,16.19 85.41,16.51 U2.11
DI
  Top 0.406: U1.51 98.74,12.7 100.01,11.43 100.01,5.4 98.74,4.13 93.03,4.13 84.77,12.38 84.77,14.61 84.14,15.24 U2.10
DIO3
  Top 0.305: U$1.17 8.86,50.51 10.16,49.21 22.23,49.21 22.86,48.58 24.13,48.58 24.77,47.94 SJ5.1 24.89,43.18 25.72,43.18 26.35,42.55 SJ1.1
DO
  Top 0.406: U1.50 89.53,12.7 88.27,13.97 88.27,18.73 87.95,19.05 U2.13
G_RDY  (via drill 0.6)
  Top 0.305: IMU_HEADER.5 63.69,34.8 64.14,35.24 64.45,35.24 64.77,35.56 v65.41,35.56
  Bottom 0.305: v65.41,35.56 65.72,35.56 66.04,35.88 68.9,35.88 69.85,36.83 69.85,44.13 70.17,44.45 88.58,44.45 89.22,43.81 89.22,42.55 89.53,42.23 91.12,42.23
  Bottom 0.406: U1.28 93.66,40.64 92.08,42.23 91.12,42.23
GND  (via drill 0.51)
  Top 1.016: JP5.1 JP3.1
  Bottom 1.016: JP5.1 JP3.1
  other vias: 17.14,7.62 15.88,7.62 14.61,7.62 13.34,7.62 12.06,7.62 10.79,7.62 17.14,3.81 15.88,3.81 14.61,3.81 13.34,3.81 12.06,3.81 10.79,3.81 9.53,3.81 10.16,8.89 11.43,8.89 12.7,8.89 13.97,8.89 15.24,8.89 16.51,8.89 17.78,8.89 16.51,2.54 15.24,2.54 13.97,2.54 12.7,2.54 11.43,2.54 10.16,2.54 17.14,13.97 15.88,13.97 14.61,13.97 14.61,12.7 14.61,11.43 14.61,10.16 15.88,10.16 17.14,10.16 16.51,15.24 27.94,5.24 47.62,16.51 48.9,16.51 50.16,16.51 52.7,25.4 51.44,25.4 33.02,22.54 33.02,23.81 33.02,25.08 33.02,26.35 17.14,18.73 17.14,20 17.14,21.27 33.02,19.37 31.75,19.37 30.48,19.37 81.92,28.57 80.64,28.57 79.38,28.57 78.11,28.57 87.63,26.67 86.36,26.67 59.05,45.72 45.09,38.1 45.09,36.2 18.41,43.18 18.41,41.91 19.68,42.55 13.97,43.18 13.97,41.91 12.7,42.55 8.89,38.73 6.35,33.02 6.35,19.68
  pour Top: 0,53.34 96.52,53.34 99.06,50.8 99.06,40.64 101.6,38.1 101.6,3.81 99.06,1.27 99.06,0 0,0 0,49.53 -1.27,50.8 -1.27,52.07
  pour Bottom: 0,53.34 96.52,53.34 99.06,50.8 99.06,40.64 101.6,38.1 101.6,3.81 99.06,1.27 99.06,0 0,0 0,45.72 -1.27,46.99 -1.27,48.26 0,49.53
GPS_RX
  Top 0.305: U1.18 78.74,49.21 78.42,48.9 65.41,48.9 65.09,48.58 65.09,47.62 63.82,46.35 62.23,46.35 61.69,45.81 GPS_HEADER.3
GPS_STATUS
  Top 0.305: U1.22 93.66,48.58 82.23,48.58 80.96,47.31 66.99,47.31 64.69,45.01 GPS_HEADER.6
GPS_TX
  Top 0.305: U1.19 81.28,48.9 80.64,48.26 66.36,48.26 66.04,47.94 66.04,47.31 64.14,45.4 62.87,45.4 62.69,45.23 GPS_HEADER.4
HOTWIRE_CONTINUITY  (via drill 0.6)
  Top 0.305: U1.A1 53.34,1.91 52.39,0.95 26.99,0.95 26.19,1.75 26.19,3.17 27.15,4.13 28.57,4.13 29.21,4.76 v29.21,6.99 | v25.08,18.41 25.08,19.63 R14.1
  Top 0.406: R13.2 R14.1
  Bottom 0.305: v29.21,6.99 29.21,8.26 26.99,10.48 26.99,15.88 25.08,17.78 v25.08,18.41
HOTWIRE_FET  (via drill 0.6)
  Top 0.305: R12.1 20.59,16.9 U$4.1 16.73,16.83 15.56,16.83 11.43,12.7 v9.68,12.7
  Bottom 0.305: U1.10 36.58,49.28 36.2,48.9 33.66,48.9 31.75,46.99 31.11,46.99 28.57,44.45 5.71,44.45 5.08,43.81 5.08,13.97 6.35,12.7 v9.68,12.7
L_RDY  (via drill 0.6)
  Top 0.305: IMU_HEADER.4 62.69,35.07 v63.82,36.2
  Bottom 0.305: v63.82,36.2 64.14,36.51 68.58,36.51 69.22,37.15 69.22,44.77 69.53,45.09 89.85,45.09 90.17,44.77 90.17,43.5 90.49,43.18 91.12,43.18
  Bottom 0.406: U1.26 91.12,43.18
N$1
  Top 0.305: R1.2 7.94,20.32 7.62,20 7.62,17.55 D1.A
N$2  (via drill 0.5)
  Top 0.305: v39.37,39.37 39.05,39.05 U3.4 | v29.21,42.23 28.13,42.23 SJ1.2
  Bottom 0.305: SJ3.1 41.59,42.23 41.27,41.91 39.69,41.91 39.37,41.59 | 39.37,41.59 v39.37,39.37 | 39.37,41.59 34.92,41.59 34.29,42.23 v29.21,42.23
N$3
  Bottom 0.813: SJ8.1 U1.3.3V
N$4  (via drill 0.5)
  Top 0.406: v48.58,37.78 D3.C
  Bottom 0.406: R5.1 49.53,38.73 v48.58,37.78
N$5  (via drill 0.6)
  Top 0.406: R13.1 21.96,16.73 U$4.2
  Top 1.016: v24.45,13.02 24.45,14.25 U$4.2 24.13,14.61 24.45,14.29
  Bottom 1.016: v24.45,13.02 24.13,12.7 24.13,6.67 24.61,6.19 JP2.2
N$6
  Bottom 0.305: Q3.1 31.39,13.7 31.11,13.97
  Bottom 0.406: SJ4.3 30.66,12.24 31.11,12.7 31.11,13.97 R24.1
N$7
  Bottom 0.406: SJ4.2 29.84,13.34 29.21,13.97 28.95,13.97 C1.2
N$8
  Bottom 0.406: B1.+ 74.93,29.21 76.2,30.48 82.72,30.48 Q4.3
N$9
  Bottom 0.406: Q2.3 48.9,41.54 R5.2
N$10  (via drill 0.5)
  Top 0.406: v51.44,37.47 D2.C
  Bottom 0.406: R3.1 v51.44,37.47
N$11
  Bottom 0.406: R3.2 52.02,40.91 52.7,41.59 Q1.3
N$15
  Top 0.406: SJ9.1 82.55,10.16 82.87,10.48 82.87,12.64 U2.8
N$17  (via drill 0.5)
  Top 0.406: SJ10.1 45.4,42.23 v46.04,42.86 | v43.81,44.77 43.5,44.77 43.18,44.45 43.18,43.76 U3.8
  Bottom 0.406: v46.04,42.86 44.13,44.77 v43.81,44.77
N$21
  Bottom 0.406: Q9.3 83.67,40.73 R17.2
N$22
  Bottom 0.406: Q7.3 83.67,36.92 R18.2
N$23
  Top 0.406: R22.2 43.81,17.78 44.45,17.14 44.45,13.97 44.13,13.65 D7.A
N$24
  Top 0.406: D8.A 42.46,17.6 R21.2
N$25
  Top 0.406: D9.A 45.09,11.11 45.72,11.75 R23.2
N$26
  Bottom 0.406: Q8.3 83.67,33.75 R25.2
N$27
  Top 0.406: JP1.1 65.09,13.97 64.14,14.92 62.28,14.92 R15.1
N$28
  Bottom 0.305: R30.1 R29.1 55.24,36.14 55.24,35.24 54.93,34.92 SJ6.2
N$29
  Bottom 1.016: U1.VIN 46.35,2.54 47.62,3.81 SJ7.1
N$30  (via drill 0.6)
  Top 0.406: R16.1 v60.33,12.06
  Bottom 0.406: v60.33,12.06 SJ2.1
N$36  (via drill 0.6)
  Top 0.406: v77.79,42.86 77.79,41.4 U$5.P$3
  Bottom 0.406: R17.1 81.02,42.49 80.64,42.86 v77.79,42.86
N$37  (via drill 0.6)
  Top 0.406: v80.33,40.96 79.06,40.96 U$5.P$2
  Bottom 0.406: R18.1 81.33,38.68 80.33,39.69 v80.33,40.96
N$38  (via drill 0.6)
  Top 0.406: v80.01,37.78 79.38,37.78 79.06,38.1 79.06,39.56 U$5.P$1
  Bottom 0.406: R25.1 80.7,35.51 80.33,35.88 80.33,37.47 v80.01,37.78
PYRO_MONITOR  (via drill 0.6)
  Top 0.406: R15.2 v62.23,10.16 62.23,8.89 60.96,7.62 60.33,7.62 58.42,5.71 56.52,5.71 55.88,5.08 U1.A2
  Bottom 0.406: v62.23,10.16 62.23,9.84 61.91,9.53 60.45,9.53 SJ2.2
RESET
  Bottom 0.406: U1.RESET 33.02,3.81 31.11,5.71 31.11,10.16 | 31.11,10.16 33.02,10.16 33.66,10.79 Q3.3 | 31.11,10.16 29.84,10.16 28.57,11.43 28.57,12.06 SJ4.1
RSSI  (via drill 0.6)
  Top 0.406: U$1.6 12.86,26.83 v12.7,26.67 | v12.38,20.32 R1.1
  Bottom 0.406: v12.7,26.67 12.7,20.64 v12.38,20.32
RST_CTL  (via drill 0.5)
  Top 0.305: 41.59,45.72 v41.27,46.04 40.96,45.72 39.69,45.72 39.05,45.09 U3.11 | U1.9 39.05,50.74 v39.05,48.58 38.42,47.94 34.29,47.94 31.11,44.77 v31.11,40.96
  Bottom 0.305: v39.05,48.58 41.27,46.35 v41.27,46.04 41.59,45.72 SJ3.2 | C1.1 28.57,20.64 27.62,21.59 27.62,35.56 27.94,35.88 27.94,40.01 28.26,40.32 30.48,40.32 v31.11,40.96
RTS_XBEE
  Top 0.305: U$1.16 10.86,46.61 11.75,45.72 21.91,45.72 22.54,45.09 22.54,40.96 22.86,40.64 24.45,40.64 24.77,40.96 SJ5.2
SCL  (via drill 0.6)
  Top 0.305: v62.23,36.2 62.23,35.88 61.69,35.34 IMU_HEADER.3 61.69,32.16 61.28,31.75 v60.01,31.75
  Bottom 0.305: U1.21 86.36,46.99 85.09,45.72 68.9,45.72 68.58,45.4 68.58,37.47 68.26,37.15 62.55,37.15 62.23,36.83 v62.23,36.2 | v60.01,31.75 58.1,31.75 57.15,32.7 57.15,36.14 R29.2
SD_CS
  Top 0.305: U2.4 76.2,16.51 74.93,17.78 73.66,17.78 72.71,18.73 72.71,20.95 68.58,25.08 64.45,25.08 60.64,28.89 52.39,28.89 48.58,32.7 16.51,32.7
  Top 0.406: U4.2 6.48,36.7 6.99,36.2 8.89,36.2 9.21,35.88 9.21,33.02 9.53,32.7 16.51,32.7
SD_DI  (via drill 0.6)
  Top 0.305: U2.5 76.2,15.24 74.3,17.14 73.34,17.14 72.07,18.41 72.07,20.64 68.26,24.45 63.82,24.45 60.01,28.26 52.07,28.26 48.58,31.75 16.83,31.75
  Top 0.406: U4.3 7.65,37.75 v7.94,37.47 | v7.94,34.92 7.94,33.02 9.21,31.75 16.83,31.75
  Bottom 0.406: v7.94,37.47 v7.94,34.92
SD_DO
  Top 0.305: U2.2 74.3,19.05 73.98,19.37 73.98,21.59 69.22,26.35 65.72,26.35 61.91,30.16 53.02,30.16 48.58,34.61 16.51,34.61
  Top 0.406: U4.7 11.21,42.13 11.43,41.91 11.43,34.92 11.75,34.61 16.51,34.61
SD_SCK
  Top 0.305: U2.3 75.88,17.78 75.25,18.41 73.98,18.41 73.34,19.05 73.34,21.27 68.9,25.72 65.09,25.72 61.28,29.53 52.7,29.53 48.58,33.66 16.51,33.66
  Top 0.406: U4.5 9.95,39.9 10.16,39.69 10.16,34.29 10.79,33.66 16.51,33.66
SDA  (via drill 0.6)
  Top 0.305: v60.64,35.88 60.64,34.02 IMU_HEADER.2
  Bottom 0.305: U1.20 83.82,46.99 83.5,46.67 68.26,46.67 67.63,46.04 67.63,38.1 67.31,37.78 60.96,37.78 60.64,37.47 | 60.64,37.47 v60.64,35.88 | R30.2 59.37,38.73 60.64,37.47
SERVO_1
  Bottom 0.305: U1.11 34.04,50.55 31.75,48.26 30.48,48.26 27.94,45.72 4.45,45.72 3.81,45.09 3.81,12.7 6.99,9.53 JP3.3
SERVO_2
  Bottom 0.305: U1.12 31.5,50.55 27.94,46.99 3.81,46.99 2.54,45.72 2.54,12.06 4.45,10.16 JP4.3
SERVO_3
  Bottom 0.305: U1.13 28.96,49.28 27.94,48.26 2.54,48.26 1.27,46.99 1.27,10.79 1.91,10.16 JP5.3
STATUS_LED_BLUE
  Bottom 0.406: Q8.1 87.58,33.65 R28.1 87.68,33.66 91.44,33.66 92.08,33.02 U1.34
STATUS_LED_GREEN
  Bottom 0.406: Q9.1 87.58,40.64 R26.1 87.68,40.64 91.44,40.64 91.76,40.32 91.76,38.73 92.39,38.1 U1.30
STATUS_LED_RED
  Bottom 0.406: Q7.1 87.58,36.83 R27.1 87.68,36.83 91.44,36.83 91.76,36.51 91.76,36.2 92.39,35.56 U1.32
V_BATT  (via drill 0.6)
  Top 0.406: R19.1 53.4,12.33 JP6.2 | C4.1 47.26,18.15 46.99,18.41 46.99,19.68 46.67,20 45.77,20 R23.1
  Top 0.813: C4.1 C15.1 51.39,18.15 51.76,17.78 | JP6.2 52.07,13.97 52.7,14.61 C14.1 C13.1
  Top 1.016: JP5.2 JP4.2 JP3.2 20,5.71 JP2.1 21.27,4.76 21.27,8.57 21.59,8.89 v44.93,8.89 47.62,8.89 51.76,13.03 JP6.2 51.76,17.78 51.76,18.09 U$2.3
  Bottom 1.016: SJ7.2 47.62,8.41 47.15,8.89 v44.93,8.89
XBEE_RX_3V3  (via drill 0.5, 0.6)
  Top 0.305: U3.2 36.51,36.83 36.2,36.51 25.4,36.51 24.77,37.15 24.77,38.42 v24.45,38.73 | v19.68,38.73 18.73,38.73
  Top 0.406: U$1.3 8.14,25.6 v8.57,26.04 | v14.92,38.73 18.73,38.73
  Bottom 0.305: v24.45,38.73 v19.68,38.73
  Bottom 0.406: v8.57,26.04 8.57,30.16 14.29,35.88 14.29,38.42 14.61,38.73 v14.92,38.73
XBEE_RX_5V
  Top 0.305: U1.1 60.96,49.21 60.64,48.9 40.64,48.9 36.51,44.77 U3.13
  Bottom 0.406: Q2.1 47.95,45.99 | 47.95,45.99 R4.1 | 47.95,45.99 47.95,48.58 48.26,48.9 60.64,48.9 60.96,49.21 U1.1
XBEE_TX_3V3  (via drill 0.6)
  Top 0.305: U3.3 37.78,36.51 36.83,35.56 24.77,35.56 22.23,38.1 22.23,39.69 21.91,40.01 18.73,40.01
  Top 0.406: U$1.2 6.33,28.6 v6.35,28.57 | v13.34,40.01 18.73,40.01
  Bottom 0.406: v6.35,28.57 6.35,30.16 12.7,36.51 12.7,39.37 v13.34,40.01
XBEE_TX_5V
  Top 0.305: U1.0 63.5,48.58 62.87,47.94 40.96,47.94 37.78,44.77 U3.12
  Bottom 0.406: Q1.1 51.76,45.99 R2.1 51.8,47.68 52.07,47.94 62.87,47.94 63.5,48.58 U1.0

### Text on the board
tPlace: XBEE | GPS | MICRO SD | TX | RX | Avionics Board | DO NOT CONFUSE | Designed by: | IMU | Roy Cohen | 6/5/15 | REV: A | MIT Rocket Team | 3v3 | V+ | V- | ALT_PYRO | RSSI | 5v | SERVOS | VBat | V_GOOD | 3 | 2 | 1 | HOTWIRE | 2S LIPO | V- | V+